# EAGLE design power-supply_combined_v1 (EAGLE 6.4)

## Sheet 1 of 5: Positive
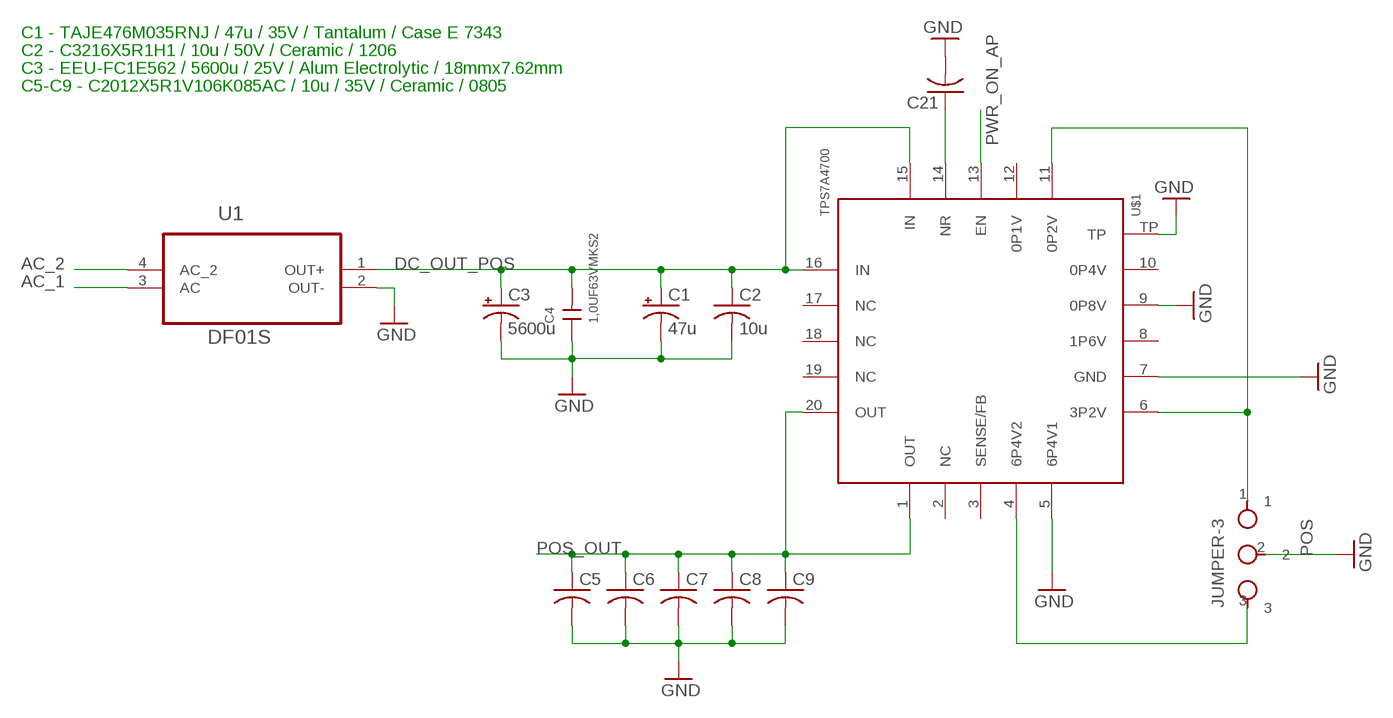
[diagram p0: schematic, sheet 1]

### Parts
C1  47u  CPOL-USSMCE  [SMC_E]
C2  10u  C-USC1206  [C1206]
C3  5600u  CPOL-USE7.5-18  [E7,5-18]
C4  1,0UF63VMKS2  [5,0X10,0RM5,0]
C5  C-USC0805  [C0805]
C6  C-USC0805  [C0805]
C7  C-USC0805  [C0805]
C8  C-USC0805  [C0805]
C9  C-USC0805  [C0805]
C21  C-USC0603  [C0603]
POS  JUMPER-3  [1X03]
U1  DF01S  [SOT508P985X260-4N]
U$1  TPS7A4700  [VQFN-20]

### Nets
AC_1: U1.3(AC)
AC_2: U1.4(AC_2)
DC_OUT_POS: C1.+ C2.1 C3.+ C4.2 U1.1(OUT+) U$1.15(IN) U$1.16(IN) ; also sheet 5
GND: C1.- C2.2 C3.- C4.1 C5.2 C6.2 C7.2 C8.2 C9.2 C21.2 POS.2 U1.2(OUT-) U$1.5(6P4V1) U$1.7(GND) U$1.9(0P8V) U$1.TP ; also sheet 2,3,4
N$2: POS.3 U$1.4(6P4V2)
N$3: POS.1 U$1.6(3P2V) U$1.11(0P2V)
N$5: C21.1 U$1.14(NR)
POS_OUT: C5.1 C6.1 C7.1 C8.1 C9.1 U$1.1(OUT) U$1.20(OUT)
PWR_ON_AP: U$1.13(EN) ; also sheet 5
Unconnected: U$1.2(NC) U$1.3(SENSE/FB) U$1.8(1P6V) U$1.10(0P4V) U$1.12(0P1V) U$1.17(NC) U$1.18(NC) U$1.19(NC)

### Notes on the sheet
- C1 - TAJE476M035RNJ / 47u / 35V / Tantalum / Case E 7343
- C2 - C3216X5R1H1 / 10u / 50V / Ceramic / 1206
- C3 - EEU-FC1E562 / 5600u / 25V / Alum Electrolytic / 18mmx7.62mm
- C5-C9 - C2012X5R1V106K085AC / 10u / 35V / Ceramic / 0805

## Sheet 2 of 5: Negative
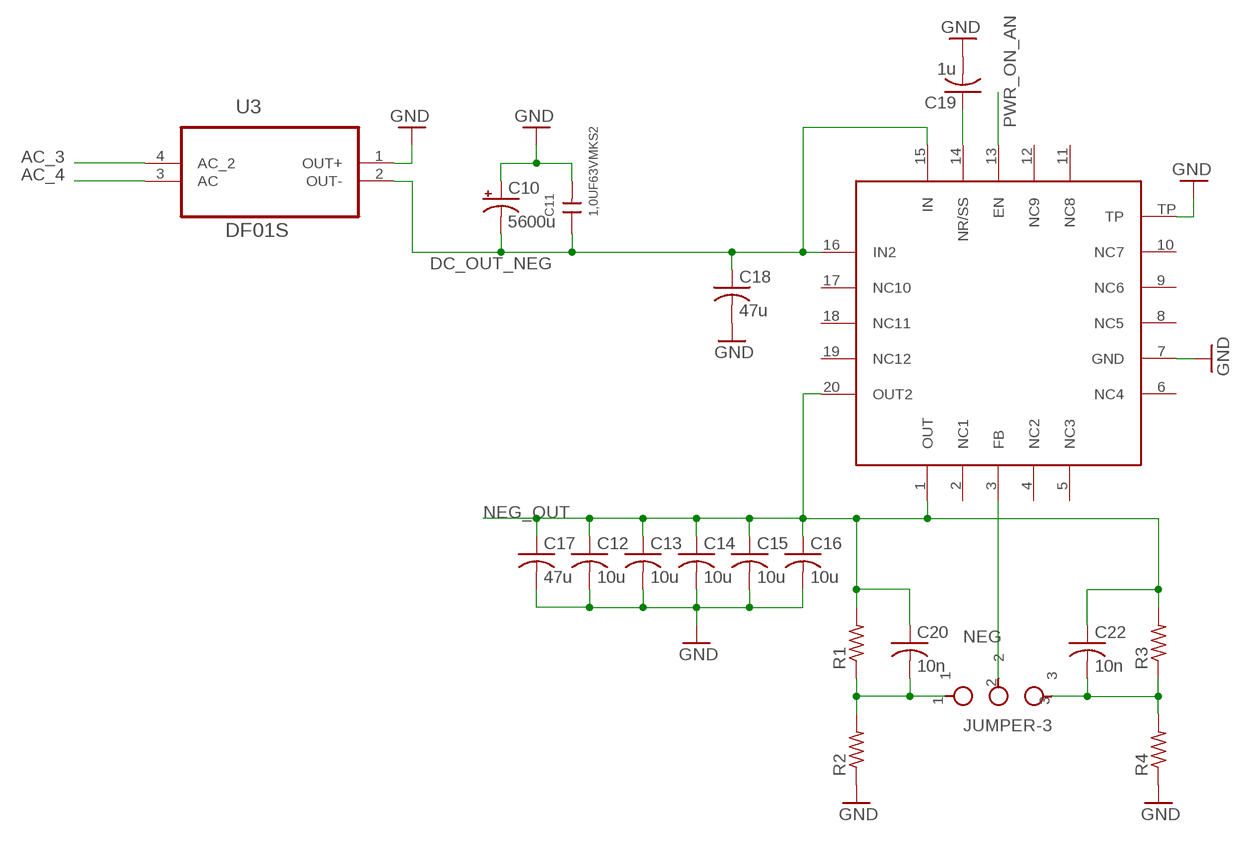
[diagram p1: schematic, sheet 2]

### Parts
C10  5600u  CPOL-USE7.5-18  [E7,5-18]
C11  1,0UF63VMKS2  [5,0X10,0RM5,0]
C12  10u  C-USC0805  [C0805]
C13  10u  C-USC0805  [C0805]
C14  10u  C-USC0805  [C0805]
C15  10u  C-USC0805  [C0805]
C16  10u  C-USC0805  [C0805]
C17  47u  C-USC2220K  [C2220K]
C18  47u  C-USC2220K  [C2220K]
C19  1u  C-USC0603  [C0603]
C20  10n  C-USC0603  [C0603]
C22  10n  C-USC0603  [C0603]
NEG  JUMPER-3  [1X03]
R1  R-US_R0603  [R0603]
R2  R-US_R0603  [R0603]
R3  R-US_R0603  [R0603]
R4  R-US_R0603  [R0603]
U3  DF01S  [SOT508P985X260-4N]
U$2  TPS7A3301RGWT  [VQFN-20]

### Nets
AC_3: U3.4(AC_2)
AC_4: U3.3(AC)
DC_OUT_NEG: C10.- C11.1 C18.1 U3.2(OUT-) U$2.15(IN) U$2.16(IN2) ; also sheet 5
GND: C10.+ C11.2 C12.2 C13.2 C14.2 C15.2 C16.2 C17.2 C18.2 C19.2 R2.1 R4.1 U3.1(OUT+) U$2.7(GND) U$2.TP ; also sheet 1,3,4
N$4: C20.2 NEG.1 R1.1 R2.2
N$6: C19.1 U$2.14(NR/SS)
N$9: C22.2 NEG.3 R3.1 R4.2
N$10: NEG.2 U$2.3(FB)
NEG_OUT: C12.1 C13.1 C14.1 C15.1 C16.1 C17.1 C20.1 C22.1 R1.2 R3.2 U$2.1(OUT) U$2.20(OUT2)
PWR_ON_AN: U$2.13(EN) ; also sheet 5
Unconnected: U$2.2(NC1) U$2.4(NC2) U$2.5(NC3) U$2.6(NC4) U$2.8(NC5) U$2.9(NC6) U$2.10(NC7) U$2.11(NC8) U$2.12(NC9) U$2.17(NC10) U$2.18(NC11) U$2.19(NC12)

## Sheet 3 of 5: 3.3V Digital
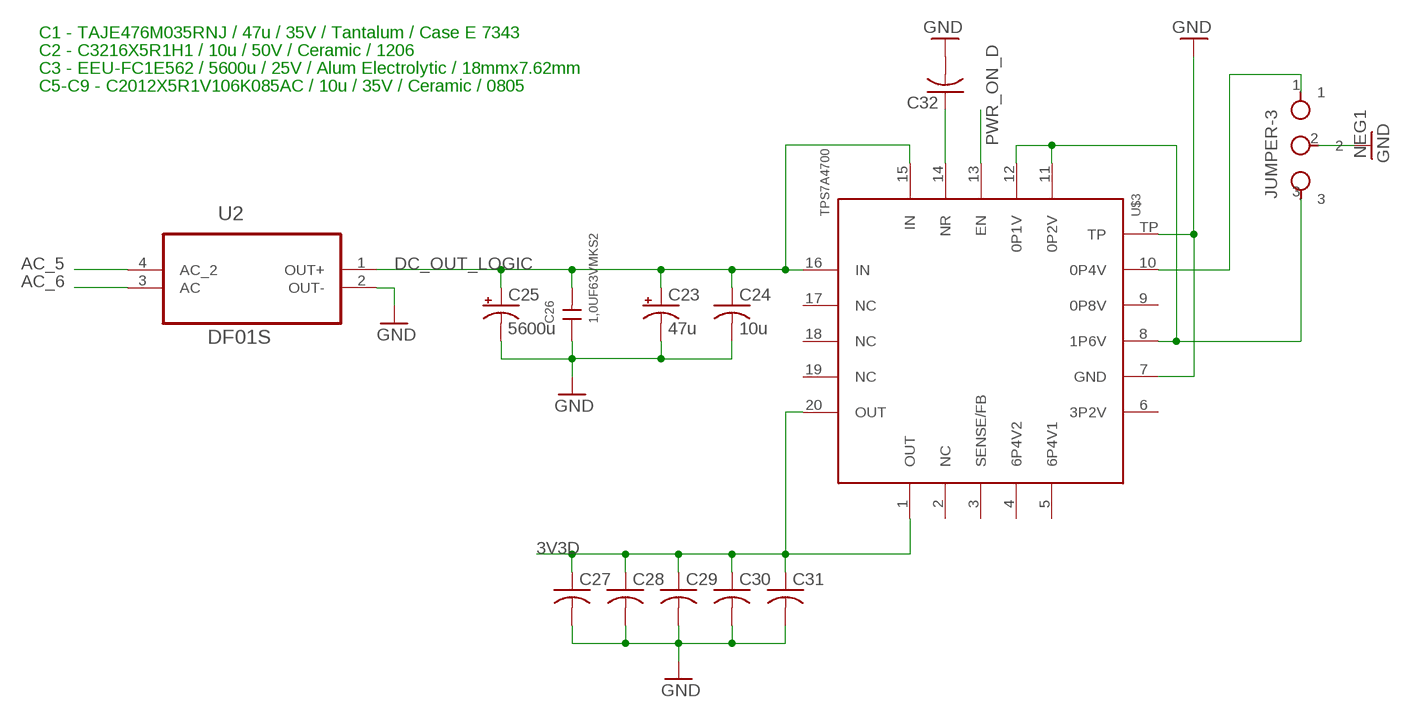
[diagram p2: schematic, sheet 3]

### Parts
C23  47u  CPOL-USSMCE  [SMC_E]
C24  10u  C-USC1206  [C1206]
C25  5600u  CPOL-USE7.5-18  [E7,5-18]
C26  1,0UF63VMKS2  [5,0X10,0RM5,0]
C27  C-USC0805  [C0805]
C28  C-USC0805  [C0805]
C29  C-USC0805  [C0805]
C30  C-USC0805  [C0805]
C31  C-USC0805  [C0805]
C32  C-USC0603  [C0603]
NEG1  JUMPER-3  [1X03]
U2  DF01S  [SOT508P985X260-4N]
U$3  TPS7A4700  [VQFN-20]

### Nets
3V3D: C27.1 C28.1 C29.1 C30.1 C31.1 U$3.1(OUT) U$3.20(OUT)
AC_5: U2.4(AC_2)
AC_6: U2.3(AC)
DC_OUT_LOGIC: C23.+ C24.1 C25.+ C26.2 U2.1(OUT+) U$3.15(IN) U$3.16(IN) ; also sheet 4,5
GND: C23.- C24.2 C25.- C26.1 C27.2 C28.2 C29.2 C30.2 C31.2 C32.2 NEG1.2 U2.2(OUT-) U$3.7(GND) U$3.TP ; also sheet 1,2,4
N$1: C32.1 U$3.14(NR)
N$12: NEG1.3 U$3.8(1P6V) U$3.11(0P2V) U$3.12(0P1V)
N$14: NEG1.1 U$3.10(0P4V)
PWR_ON_D: U$3.13(EN) ; also sheet 4,5
Unconnected: U$3.2(NC) U$3.3(SENSE/FB) U$3.4(6P4V2) U$3.5(6P4V1) U$3.6(3P2V) U$3.9(0P8V) U$3.17(NC) U$3.18(NC) U$3.19(NC)

### Notes on the sheet
- C1 - TAJE476M035RNJ / 47u / 35V / Tantalum / Case E 7343
- C2 - C3216X5R1H1 / 10u / 50V / Ceramic / 1206
- C3 - EEU-FC1E562 / 5600u / 25V / Alum Electrolytic / 18mmx7.62mm
- C5-C9 - C2012X5R1V106K085AC / 10u / 35V / Ceramic / 0805

## Sheet 4 of 5: 5V Analog
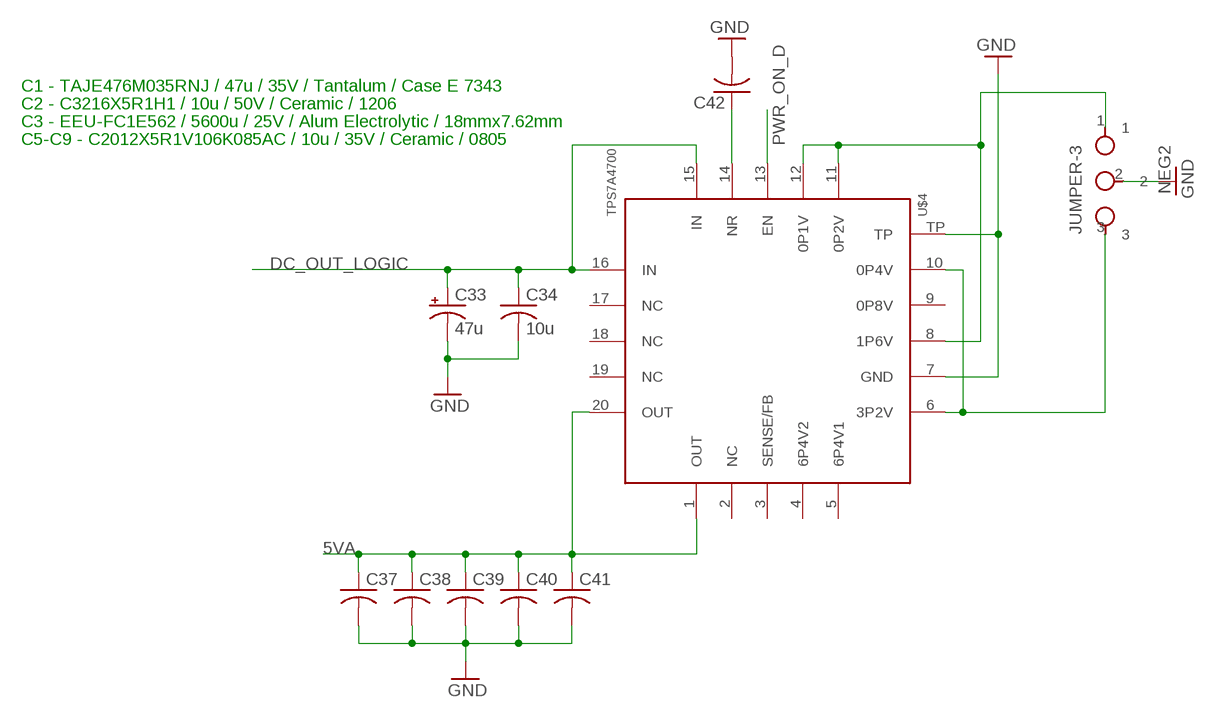
[diagram p3: schematic, sheet 4]

### Parts
C33  47u  CPOL-USSMCE  [SMC_E]
C34  10u  C-USC1206  [C1206]
C37  C-USC0805  [C0805]
C38  C-USC0805  [C0805]
C39  C-USC0805  [C0805]
C40  C-USC0805  [C0805]
C41  C-USC0805  [C0805]
C42  C-USC0603  [C0603]
NEG2  JUMPER-3  [1X03]
U$4  TPS7A4700  [VQFN-20]

### Nets
5VA: C37.1 C38.1 C39.1 C40.1 C41.1 U$4.1(OUT) U$4.20(OUT)
DC_OUT_LOGIC: C33.+ C34.1 U$4.15(IN) U$4.16(IN) ; also sheet 3,5
GND: C33.- C34.2 C37.2 C38.2 C39.2 C40.2 C41.2 C42.2 NEG2.2 U$4.7(GND) U$4.TP ; also sheet 1,2,3
N$7: NEG2.3 U$4.6(3P2V) U$4.10(0P4V)
N$8: NEG2.1 U$4.8(1P6V) U$4.11(0P2V) U$4.12(0P1V)
N$11: C42.1 U$4.14(NR)
PWR_ON_D: U$4.13(EN) ; also sheet 3,5
Unconnected: U$4.2(NC) U$4.3(SENSE/FB) U$4.4(6P4V2) U$4.5(6P4V1) U$4.9(0P8V) U$4.17(NC) U$4.18(NC) U$4.19(NC)

### Notes on the sheet
- C1 - TAJE476M035RNJ / 47u / 35V / Tantalum / Case E 7343
- C2 - C3216X5R1H1 / 10u / 50V / Ceramic / 1206
- C3 - EEU-FC1E562 / 5600u / 25V / Alum Electrolytic / 18mmx7.62mm
- C5-C9 - C2012X5R1V106K085AC / 10u / 35V / Ceramic / 0805

## Sheet 5 of 5
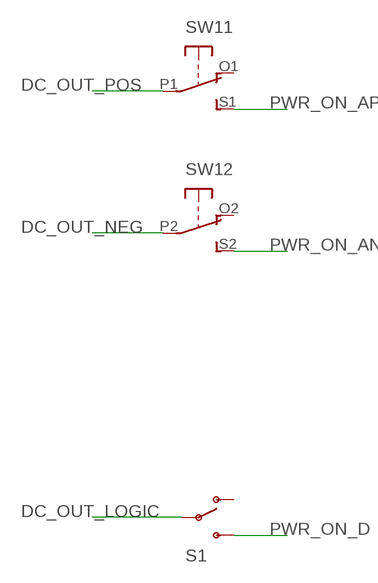
[diagram p4: schematic, sheet 5]

### Parts
S1  SWITCH-SPDTSMD  [AYZ0202]
SW1  DPDT-EG1390  [EG1390]

### Nets
DC_OUT_LOGIC: S1.2(P) ; also sheet 3,4
DC_OUT_NEG: SW1.P2(2:P) ; also sheet 2
DC_OUT_POS: SW1.P1(1:P) ; also sheet 1
PWR_ON_AN: SW1.S2(2:S) ; also sheet 2
PWR_ON_AP: SW1.S1(1:S) ; also sheet 1
PWR_ON_D: S1.3(S) ; also sheet 3,4
Unconnected: S1.1(O) SW1.O1(1:O) SW1.O2(2:O)

## Library data of the parts
C1 C3 C10 C23 C25 C33 = rcl:CPOL-US: POLARIZED CAPACITOR, American symbol
C2 C5-C9 C12-C22 C24 C27-C32 C34 C37-C42 = rcl:C-US: CAPACITOR, American symbol
C4 C11 C26 = wima_c:1,0UF63V
NEG NEG1 NEG2 POS = pinhead:JUMPER-3
R1-R4 = rcl:R-US_: RESISTOR, American symbol
S1 = SparkFun-Electromechanical:SWITCH-SPDT: SPDT Switch Simple slide switch, Spark Fun Electronics SKU : COM-00102 DPDT SMT slide switch, AYZ0202, SWCH-08179; PROD_ID: SWCH-08179
SW1 = adafruit:DPDT
U1-U3 = Fairchild_By_element14_Batch_1:DF01S: Bridge Rectifiers; MPN: DF01S; OC_FARNELL: 1470959; OC_NEWARK: 84K0208; PACKAGE: SDIP-4; SUPPLIER: Fairchild
U$1 U$3 U$4 = ti_ldo:TPS7A4700
U$2 = ti_ldo:TPS7A3301RGWT: Ultra-Low Noise NEGATIVE Voltage Reglator

## Board
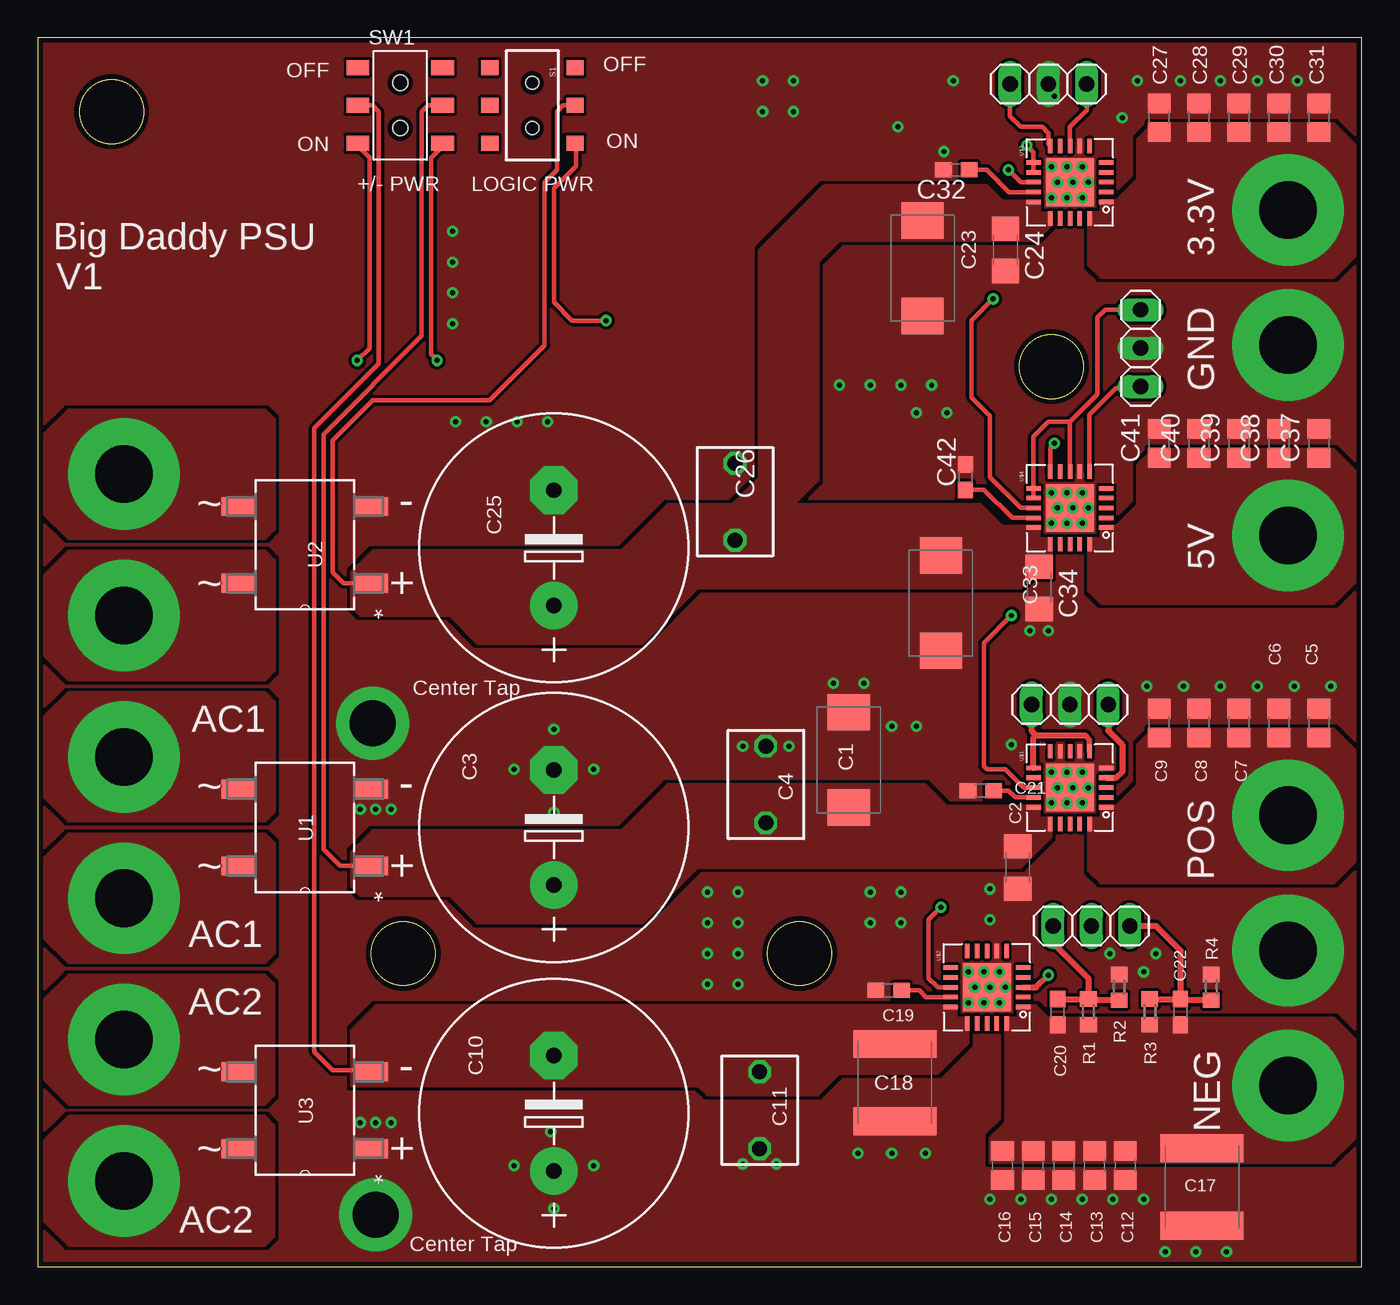
[diagram p5: board, top side]
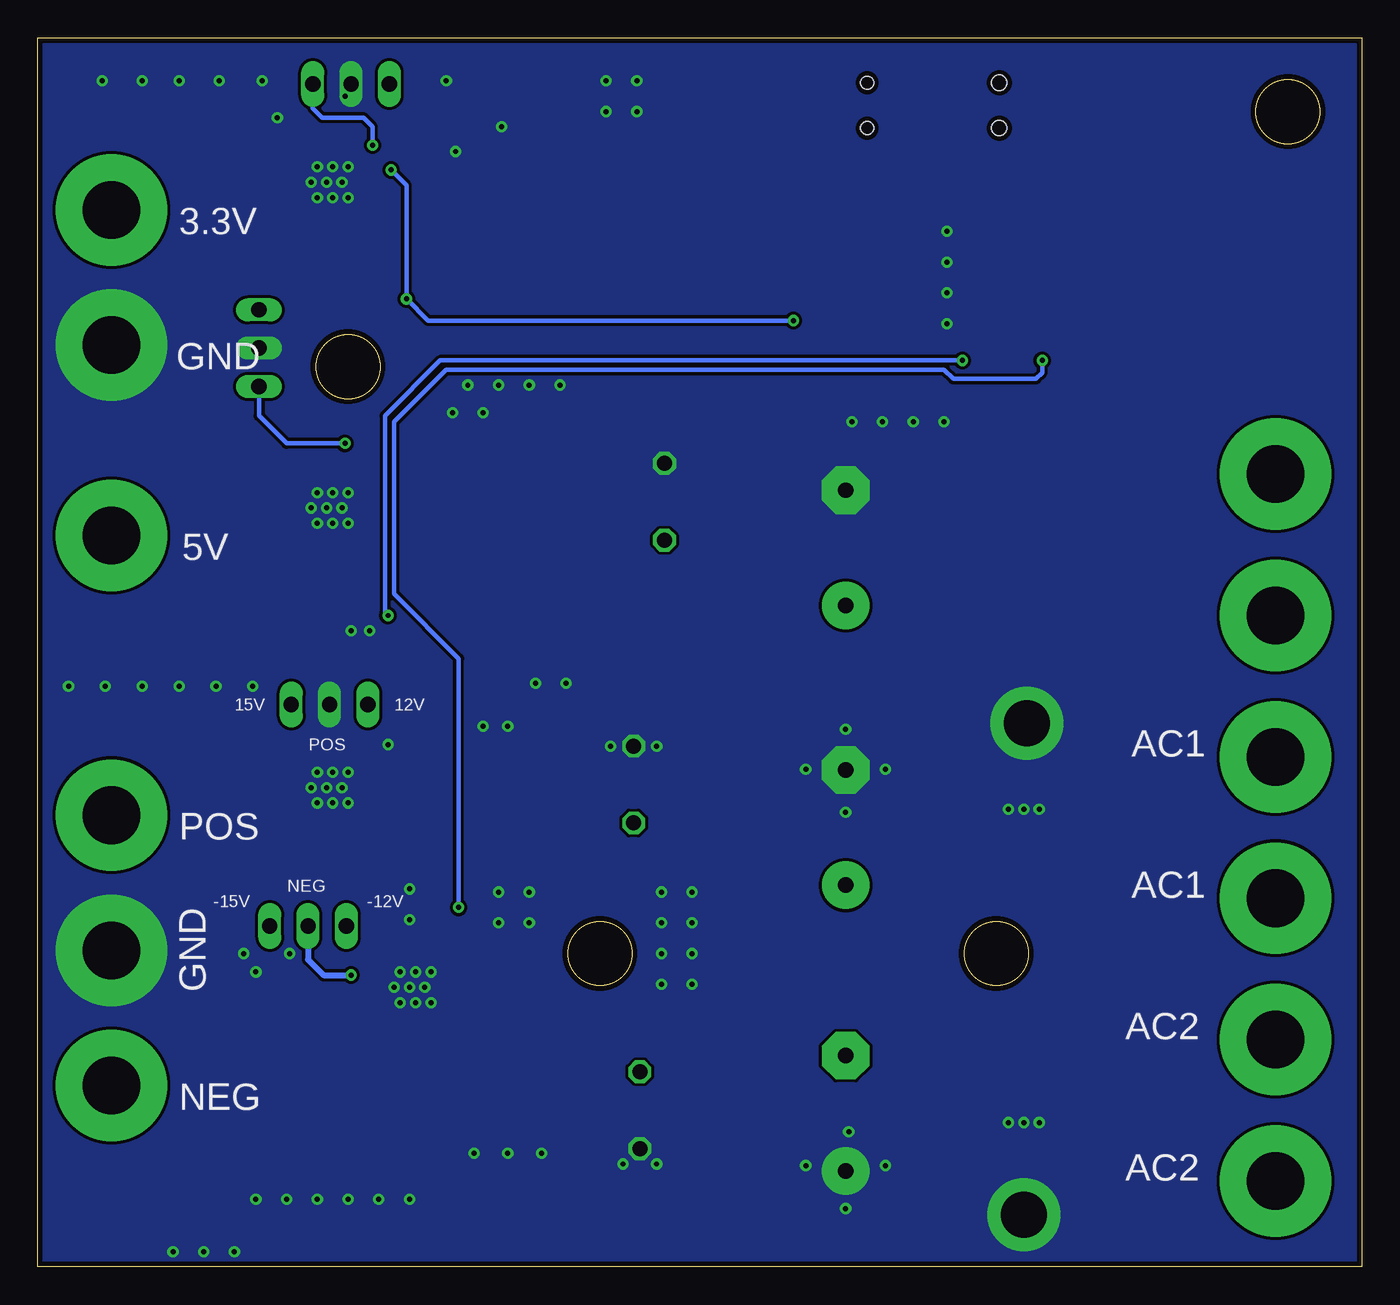
[diagram p6: board, bottom side, seen from below]

Size 87.58 x 81.28 mm. Coordinates in mm from the lower left corner, seen from the top.
Outline: 0,0 87.58,0 87.58,81.28 0,81.28 0,0
Outline: circle at 24.18,20.73 radius 2.12
Outline: circle at 50.39,20.73 radius 2.12
Outline: circle at 67.06,59.54 radius 2.12
Outline: circle at 4.88,76.4 radius 2.12
Copper layers (1*16): Top 0.035mm / dielectric 1.5mm / Bottom 0.035mm
Design rules "default *": minimum track width 10mil, minimum drill 24mil, track to track 8mil, track to pad 8mil, pad to pad 8mil, via to via 8mil, smd to smd 8mil, copper to edge 13mil, drill to drill 8mil, minimum pad ring 10mil, minimum via ring 8mil, stop-mask expansion 4mil, vias tented up to drill 14mil, thermal gap 10mil

### Footprints (pad centres in the part's own frame; a part is rotated, then mirrored left to right if it is on the bottom)
SMC_E = smd 2.4 x 2.8: + -3.15,0; - 3.15,0
C1206 = smd 1.6 x 1.8: 1 -1.4,0; 2 1.4,0
E7,5-18 = drill 1.016 pad 3.15: + -3.81,0 | drill 1.016 pad 3.15 octagon: - 3.81,0
5,0X10,0RM5,0 = drill 1 pad 1.5 octagon: 1 -2.54,0; 2 2.54,0
C0805 = smd 1.3 x 1.5: 1 -0.95,0; 2 0.95,0
C2220K = smd 1.85 x 5.5: 1 -2.55,0; 2 2.55,0
C0603 = smd 1.1 x 1: 1 -0.85,0; 2 0.85,0
1X03 = drill 1.016 long: 1 -2.54,0; 2 0,0; 3 2.54,0
R0603 = smd 1 x 1.1: 1 -0.85,0; 2 0.85,0
AYZ0202 = smd 1 x 1.15: 1 -2.5,2.825; 2 0,2.825; 3 2.5,2.825; 4 -2.5,-2.825; 5 0,-2.825; 6 2.5,-2.825 | hole 0.85: 1.5,0; -1.5,0
EG1390 = smd 1 x 1.5: O1 -2.5,2.8; O2 -2.5,-2.8; P1 0,2.8; P2 0,-2.8; S1 2.5,2.8; S2 2.5,-2.8 | hole 1: 1.5,0; -1.5,0
SOT508P985X260-4N = smd 2.235 x 1.245: 1 -4.394,2.54; 2 -4.394,-2.54; 3 4.394,-2.54; 4 4.394,2.54
VQFN-20 = smd 0.3 x 0.95: 1 -1.3,-2.4; 2 -0.65,-2.4; 3 0,-2.4; 4 0.65,-2.4; 5 1.3,-2.4; 11 1.3,2.4; 12 0.65,2.4; 13 0,2.4; 14 -0.65,2.4; 15 -1.3,2.4 | smd 0.95 x 0.3: 6 2.4,-1.3; 7 2.4,-0.65; 8 2.4,0; 9 2.4,0.65; 10 2.4,1.3; 16 -2.4,1.3; 17 -2.4,0.65; 18 -2.4,0; 19 -2.4,-0.65; 20 -2.4,-1.3 | smd 3.15 x 3.15: TP 0,0

### Placement (x,y rotation side)
C1  53.64,33.53 90 top
C2  64.82,26.42 270 top
C3  34.14,29.06 90 top
C4  48.16,31.9 270 top
C5  84.73,35.97 90 top
C6  82.09,35.97 90 top
C7  79.45,35.97 90 top
C8  76.81,35.97 90 top
C9  74.17,35.97 90 top
C10  34.14,10.16 90 top
C11  47.75,10.36 270 top
C12  71.93,6.71 270 top
C13  69.9,6.71 270 top
C14  67.87,6.71 270 top
C15  65.84,6.71 270 top
C16  63.8,6.71 270 top
C17  77.01,5.28 270 top
C18  56.69,12.19 270 top
C19  56.29,18.29 180 top
C20  67.46,16.87 90 top
C21  62.38,31.5 180 top
C22  75.59,16.87 90 top
C23  58.52,66.04 270 top
C24  64.01,67.26 270 top
C25  34.14,47.55 90 top
C26  46.13,50.6 270 top
C27  74.17,76 90 top
C28  76.81,76 90 top
C29  79.45,76 90 top
C30  82.09,76 90 top
C31  84.73,76 90 top
C32  60.76,72.54 180 top
C33  59.74,43.89 270 top
C34  66.24,44.91 270 top
C37  84.73,54.46 90 top
C38  82.09,54.46 90 top
C39  79.45,54.46 90 top
C40  76.81,54.46 90 top
C41  74.17,54.46 90 top
C42  61.37,52.22 90 top
NEG  69.7,22.56 0 top
NEG1  66.85,78.23 0 top
NEG2  72.95,60.76 270 top
POS  68.28,37.19 0 top
R1  69.49,16.87 270 top
R2  71.53,18.49 270 top
R3  73.56,16.87 270 top
R4  77.62,18.49 270 top
S1  32.72,76.81 270 top
SW1  23.98,76.81 270 top
U1  17.68,29.06 180 top
U2  17.68,47.75 180 top
U3  17.68,10.36 180 top
U$1  68.28,31.7 90 top
U$2  62.79,18.49 90 top
U$3  68.28,71.73 90 top
U$4  68.28,50.19 90 top

### Tracks (layer width: path | path; a pad name or v marks a point on that pad's centre or on a via)
3V3D  (via drill 3.81 pad 7.37)
  other vias: 82.7,69.9
  pour Top (no thermals): 69.49,69.7 69.49,66.24 70.31,65.43 85.75,65.43 87.17,66.85 87.17,74.17 85.75,75.59 73.76,75.59 72.75,74.57 72.75,71.93 71.32,70.51 70.31,70.51 70.31,69.7
5VA  (via drill 3.81 pad 7.37)
  other vias: 82.7,48.36
  pour Top (no thermals): 69.49,48.16 69.49,44.7 70.31,43.89 85.75,43.89 87.17,45.31 87.17,52.63 85.75,54.05 73.76,54.05 72.75,53.04 72.75,50.39 71.32,48.97 70.31,48.97 70.31,48.16
AC_1  (via drill 3.81 pad 7.37)
  other vias: 5.69,33.73
  pour Top (no thermals): 5.69,29.46 2.03,29.46 0.41,31.09 0.41,36.37 2.03,38 15.04,38 15.65,37.39 15.65,30.07 15.04,29.46
AC_2  (via drill 3.81 pad 7.37)
  other vias: 5.69,24.38
  pour Top (no thermals): 15.04,20.12 2.03,20.12 0.41,21.74 0.41,27.03 2.03,28.65 15.04,28.65 15.65,28.04 15.65,20.73
AC_3  (via drill 3.81 pad 7.37)
  other vias: 5.69,5.69
  pour Top (no thermals): 15.04,9.96 2.03,9.96 0.41,8.33 0.41,3.05 2.03,1.42 15.04,1.42 15.65,2.03 15.65,9.35
AC_4  (via drill 3.81 pad 7.37)
  other vias: 5.69,15.04
  pour Top (no thermals): 5.69,19.3 2.03,19.3 0.41,17.68 0.41,12.4 2.03,10.77 15.04,10.77 15.65,11.38 15.65,18.69 15.04,19.3
AC_5  (via drill 3.81 pad 7.37)
  other vias: 5.69,43.08
  pour Top (no thermals): 5.69,38.81 2.03,38.81 0.41,40.44 0.41,45.72 2.03,47.35 15.04,47.35 15.65,46.74 15.65,39.42 15.04,38.81
AC_6  (via drill 3.81 pad 7.37)
  other vias: 5.69,52.43
  pour Top (no thermals): 5.69,48.16 2.03,48.16 0.41,49.78 0.41,55.07 2.03,56.69 15.04,56.69 15.65,56.08 15.65,48.77 15.04,48.16
DC_OUT_LOGIC
  Top 0.305: U2.1 20.22,45.21 19.51,45.92 19.51,54.66 22.15,57.3 29.87,57.3 33.53,60.96 33.53,71.73 34.34,72.54 34.34,76.4 34.75,76.81 S1.2
  pour Top (no thermals): 21.34,43.08 27.23,43.08 29.06,41.25 40.03,41.25 43.69,44.91 65.02,44.91 67.06,46.94 67.06,48.16 66.24,48.16 66.24,48.97 63.8,48.97 62.38,50.39 41.66,50.39 38.61,47.35 22.15,47.35 20.73,45.92 20.73,43.69
  pour Top (no thermals): 63.8,70.51 66.24,70.51 66.24,69.7 67.06,69.7 67.06,68.88 66.04,67.87 53.04,67.87 51.61,66.45 51.61,52.02 46.53,46.94 45.11,46.94 44.5,47.55 44.5,49.78 45.11,50.39 45.92,50.39 47.75,52.22 47.75,67.26 52.02,71.53 62.79,71.53
DC_OUT_NEG
  Top 0.305: SW1.P2 22.15,76.81 22.55,76.4 22.55,59.74 18.29,55.47 18.29,14.22 19.51,13 21.97,13 U3.2
  pour Top (no thermals): 20.73,11.99 43.69,11.99 44.3,11.38 51.61,11.38 53.04,12.8 59.54,12.8 61.57,14.83 61.57,16.46 60.76,16.46 60.76,17.27 22.35,17.27 20.73,15.65
DC_OUT_POS
  Top 0.305: U1.1 20.02,26.52 18.9,27.64 18.9,55.07 25.4,61.57 25.4,76.4 25.81,76.81 SW1.P1
  pour Top (no thermals): 21.34,24.59 27.23,24.59 29.06,22.76 40.03,22.76 43.69,26.42 65.02,26.42 67.06,28.45 67.06,29.67 66.24,29.67 66.24,30.48 60.15,30.48 58.72,31.9 41.66,31.9 38.61,28.85 22.15,28.85 20.73,27.43 20.73,25.2
GND  (via drill 0.33, 3.05 pad 4.83, 3.81 pad 7.37)
  other vias: 22.15,35.97 22.35,3.45 67.06,32.72 68.07,32.72 69.09,32.72 69.49,31.7 68.48,31.7 67.46,31.7 67.06,30.68 68.07,30.68 69.09,30.68 61.57,19.51 62.59,19.51 63.6,19.51 64.01,18.49 62.99,18.49 61.98,18.49 61.57,17.48 62.59,17.48 63.6,17.48 62.99,4.47 65.02,4.47 67.06,4.47 69.09,4.47 71.12,4.47 73.15,4.47 74.57,1.02 76.61,1.02 78.64,1.02 54.25,7.52 56.49,7.52 58.72,7.52 21.34,30.28 22.35,30.28 23.37,30.28 21.34,9.55 22.35,9.55 23.37,9.55 34.14,3.86 34.14,35.56 36.78,32.92 31.5,32.92 34.14,30.07 36.78,6.71 31.5,6.71 33.93,8.94 46.63,34.44 49.68,34.44 48.87,6.81 46.63,6.81 85.55,38.4 83.11,38.4 80.67,38.4 78.23,38.4 75.79,38.4 73.36,38.4 56.49,35.76 58.12,35.76 73.15,19.51 64.41,34.54 70.92,20.73 52.63,38.61 54.66,38.61 73.96,20.73 44.3,24.79 44.3,22.76 44.3,20.73 44.3,18.69 46.33,24.79 46.33,22.76 46.33,20.73 46.33,18.69 62.99,24.99 62.99,22.96 55.07,24.79 55.07,22.76 57.1,24.79 57.1,22.76 82.7,20.93 82.7,60.96 27.43,68.48 27.43,66.45 27.43,64.41 27.43,62.38 47.96,78.44 47.96,76.4 49.99,78.44 49.99,76.4 59.94,73.76 56.9,75.39 53.04,58.32 55.07,58.32 57.1,58.32 59.13,58.32 58.12,56.49 60.15,56.49 27.64,55.88 29.67,55.88 31.7,55.88 33.73,55.88 60.55,78.44 67.26,77.42 72.75,78.44 71.73,76 75.59,78.44 78.23,78.44 80.67,78.44 83.31,78.44 67.06,51.21 68.07,51.21 69.09,51.21 67.46,50.19 68.48,50.19 69.49,50.19 67.06,49.17 68.07,49.17 69.09,49.17 65.63,42.06 66.85,42.06 67.06,72.75 67.06,70.71 68.07,70.71 69.09,70.71 67.46,71.73 68.48,71.73 69.49,71.73 69.09,72.75 68.07,72.75
  pour Top (rank 6, no thermals): 0.41,80.87 87.17,80.87 87.17,0.41 0.41,0.41
  pour Bottom (rank 6, no thermals): 0.41,80.87 87.17,80.87 87.17,0.41 0.41,0.41
N$1
  Top 0.305: U$3.14 64.25,71.08 62.79,72.54 C32.1
N$2
  Top 0.406: POS.3 70.81,35.46 71.73,34.54 71.73,32.72 71.36,32.35 U$1.4
N$3
  Top 0.356: U$1.6 69.58,34.87 69.29,35.15
  Top 0.406: POS.1 65.73,35.46 66.04,35.15 | 66.04,35.15 69.29,35.15 | U$1.11 65.88,34.99 66.04,35.15
N$4
  Top 0.406: C20.2 R1.1 | R2.2 69.57,17.64 R1.1 | NEG.1 67.16,21.44 69.49,19.1 R1.1
N$5
  Top 0.305: U$1.14 64.66,31.05 64.21,31.5 C21.1
N$6
  Top 0.305: U$2.14 58.77,17.84 58.32,18.29 C19.1
N$7  (via drill 0.33)
  Top 0.305: U$4.10 66.97,54.17 v67.26,54.46 | U$4.6 69.58,56.37 71.32,58.12 72.85,58.12 NEG2.3
  Bottom 0.305: v67.26,54.46 71.12,54.46 72.95,56.29 NEG2.3
N$8
  Top 0.305: NEG2.1 70.61,63.3 70.1,62.79 70.1,57.71 68.28,55.88 | 68.28,55.88 U$4.8 | 68.28,55.88 66.85,55.88 65.88,54.9 U$4.11 U$4.12
N$9
  Top 0.406: NEG.3 73.97,22.56 75.59,20.93 C22.2 | R3.1 C22.2 | R4.2 75.67,17.64 C22.2
N$10  (via drill 0.33)
  Top 0.406: U$2.3 66.04,18.49 v66.85,19.3
  Bottom 0.406: NEG.2 69.7,20.32 68.68,19.3 v66.85,19.3
N$11
  Top 0.305: U$4.14 64.45,49.54 62.59,51.41 61.4,51.41 C42.1
N$12  (via drill 0.33)
  Top 0.305: NEG1.3 69.39,76.5 68.28,75.39 U$3.8 | U$3.12 U$3.11 65.88,73.72 v65.43,74.17
  Bottom 0.305: v65.43,74.17 65.43,75.39 66.04,76 68.78,76 69.39,76.61 NEG1.3
N$14
  Top 0.305: NEG1.1 64.31,76.1 65.02,75.39 66.45,75.39 66.85,74.98 66.85,74.25 U$3.10
NEG_OUT  (via drill 3.81 pad 7.37)
  other vias: 82.7,11.99
  pour Top (no thermals): 64.01,16.46 64.01,9.55 62.99,8.53 62.99,6.91 85.55,6.91 87.17,8.53 87.17,15.04 85.75,16.46 66.85,16.46 66.04,17.27 64.82,17.27 64.82,16.46
POS_OUT  (via drill 3.81 pad 7.37)
  other vias: 82.7,29.87
  pour Top (no thermals): 69.49,29.67 69.49,26.21 70.31,25.4 85.75,25.4 87.17,26.82 87.17,34.14 85.75,35.56 73.76,35.56 72.75,34.54 72.75,31.9 71.32,30.48 70.31,30.48 70.31,29.67
PWR_ON_AN  (via drill 0.33)
  Top 0.305: U$2.13 59.54,18.49 58.93,19.1 58.93,22.96 v59.74,23.77 | SW1.S2 21.13,74.26 21.13,74.17 21.95,73.36 21.95,60.76 v21.13,59.94
  Bottom 0.305: v59.74,23.77 59.74,40.23 64.01,44.5 64.01,55.88 60.55,59.33 27.64,59.33 27.03,58.72 21.54,58.72 21.13,59.13 v21.13,59.94
PWR_ON_AP  (via drill 0.33)
  Top 0.305: SW1.S1 26.78,74.12 26.01,73.36 26.01,60.35 v26.42,59.94 | v64.41,43.08 62.59,41.25 62.59,33.12 62.79,32.92 64.01,32.92 65.23,31.7 U$1.13
  Bottom 0.305: v26.42,59.94 60.96,59.94 64.62,56.29 64.62,43.28 v64.41,43.08
PWR_ON_D  (via drill 0.33)
  Top 0.305: S1.3 35.6,74.37 35.6,72.79 34.14,71.32 34.14,63.8 35.36,62.59 v37.59,62.59 | U$4.13 65.02,50.19 62.99,52.22 62.99,56.29 61.77,57.51 61.77,62.59 v63.2,64.01 | U$3.13 65.02,71.73 v64.21,72.54
  Bottom 0.305: v37.59,62.59 61.77,62.59 v63.2,64.01 63.2,71.53 v64.21,72.54

### Text on the board
tPlace: OFF | OFF | ON | ON | +/- PWR | LOGIC PWR | Big Daddy PSU | 3.3V | V1 | GND | 5V | Center Tap | AC1 | POS | AC1 | AC2 | NEG | AC2 | Center Tap
bPlace: 3.3V | GND | 5V | 12V | 15V | AC1 | POS | AC1 | -12V | -15V | GND | AC2 | NEG | AC2